# Altium schematic sheet timing.SchDoc
size A4; SheetNumber: 5; SheetTotal: 5
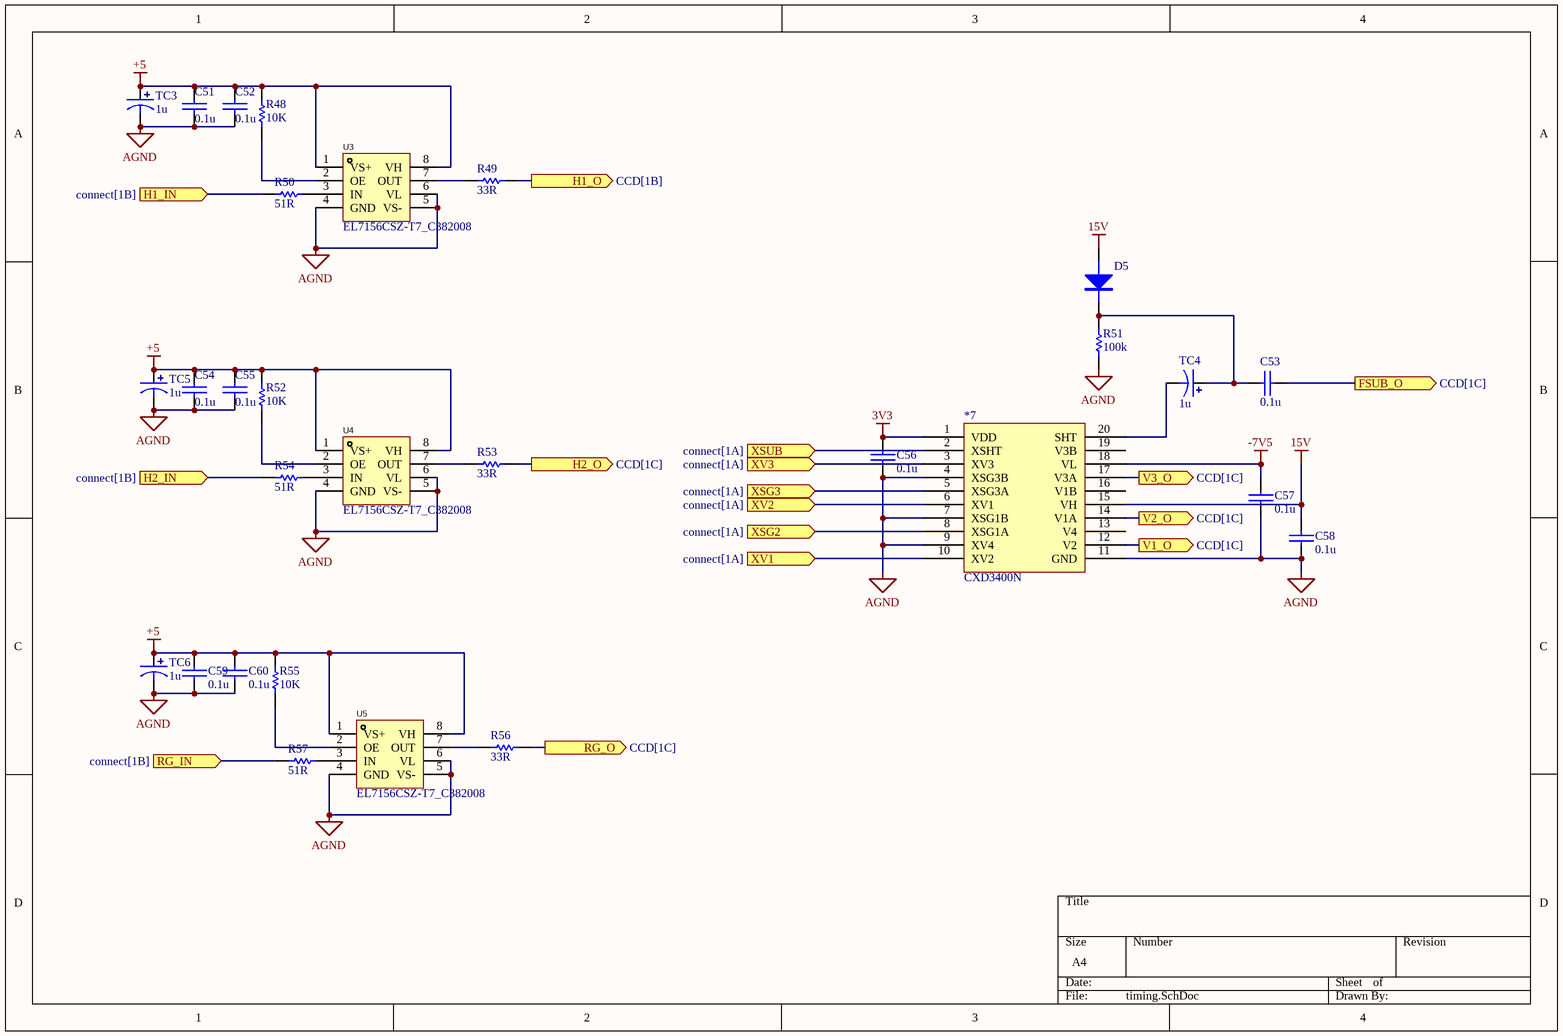
[diagram p0: timing.SchDoc]

## Parts
*7  CXD3400N  [CXD3400N]
C51  0.1u  [0603C]
C52  0.1u  [0603C]
C53  0.1u  [0603C]
C54  0.1u  [0603C]
C55  0.1u  [0603C]
C56  0.1u  [0603C]
C57  0.1u  [0603C]
C58  0.1u  [0603C]
C59  0.1u  [0603C]
C60  0.1u  [0603C]
D5  DIODE  [SMA/DO-214AC]  (value not drawn)
R48  10K  [0603R]
R49  33R  [0603R]
R50  51R  [0603R]
R51  100k  [0603R]
R52  10K  [0603R]
R53  33R  [0603R]
R54  51R  [0603R]
R55  10K  [0603R]
R56  33R  [0603R]
R57  51R  [0603R]
TC3  1u  [TAJ-A/3216]
TC4  1u  [TAJ-A/3216]
TC5  1u  [TAJ-A/3216]
TC6  1u  [TAJ-A/3216]
U3  EL7156CSZ-T7_C382008  [SOIC-8]
U4  EL7156CSZ-T7_C382008  [SOIC-8]
U5  EL7156CSZ-T7_C382008  [SOIC-8]

## Ports
FSUB_O (out, see CCD[1C]), H1_IN (in, see connect[1B]), H1_O (out, see CCD[1B]), H2_IN (in, see connect[1B]), H2_O (out, see CCD[1C]), RG_IN (in, see connect[1B]), RG_O (out, see CCD[1C]), V1_O (out, see CCD[1C]), V2_O (out, see CCD[1C]), V3_O (out, see CCD[1C]), XSG2 (in, see connect[1A]), XSG3 (in, see connect[1A]), XSUB (in, see connect[1A]), XV1 (in, see connect[1A]), XV2 (in, see connect[1A]), XV3 (in, see connect[1A])

## Nets
3V3: *7.1(VDD) C56.2
15V: *7.15(VH) C58.2 D5.A
+5: C51.1 C52.1 C54.1 C55.1 C59.1 C60.1 R48.1 R52.1 R55.1 TC3.1 TC5.1 TC6.1 U3.1(VS+) U3.8(VH) U4.1(VS+) U4.8(VH) U5.1(VS+) U5.8(VH)
-7V5: *7.18(VL) C57.2
AGND: *7.4(XSG3B) *7.7(XSG1B) *7.9(XV4) *7.11(GND) C51.2 C52.2 C54.2 C55.2 C56.1 C57.1 C58.1 C59.2 C60.2 R51.1 TC3.2 TC5.2 TC6.2 U3.4(GND) U3.5(VS-) U3.6(VL) U4.4(GND) U4.5(VS-) U4.6(VL) U5.4(GND) U5.5(VS-) U5.6(VL)
FSUB_O: C53.1 ; port FSUB_O
H1_IN: R50.2 ; port H1_IN
H1_O: R49.1 ; port H1_O
H2_IN: R54.2 ; port H2_IN
H2_O: R53.1 ; port H2_O
RG_IN: R57.2 ; port RG_IN
RG_O: R56.1 ; port RG_O
V1_O: *7.12(V2) ; port V1_O
V2_O: *7.14(V1A) ; port V2_O
V3_O: *7.17(V3A) ; port V3_O
XSG2: *7.8(XSG1A) ; port XSG2
XSG3: *7.5(XSG3A) ; port XSG3
XSUB: *7.2(XSHT) ; port XSUB
XV1: *7.10(XV2) ; port XV1
XV2: *7.6(XV1) ; port XV2
XV3: *7.3(XV3) ; port XV3
Net*7_20: *7.20(SHT) TC4.2
NetC53_2: C53.2 D5.K R51.2 TC4.1
NetR48_2: R48.2 U3.2(OE)
NetR49_2: R49.2 U3.7(OUT)
NetR50_1: R50.1 U3.3(IN)
NetR52_2: R52.2 U4.2(OE)
NetR53_2: R53.2 U4.7(OUT)
NetR54_1: R54.1 U4.3(IN)
NetR55_2: R55.2 U5.2(OE)
NetR56_2: R56.2 U5.7(OUT)
NetR57_1: R57.1 U5.3(IN)

Not connected (* = marked no-connect by the designer): *7 13(V4) 16(V1B) 19(V3B)

## Library data of the parts
*7 = CXD3400N: 6通道垂直时钟驱动器
C51-C60 = CAP: 无极性电容
D5 = DIODE: 普通二极管
R48-R57 = RES: 电阻
TC3-TC6 = TCAP: 钽电容
U3-U5 = EL7156CSZ-T7: 栅极驱动器; Manufacturer: Intersil(英特矽尔); Add into BOM: yes; Name: EL7156CSZ-T7; Symbol: EL7156CSZ-T7; Device: EL7156CSZ-T7_C382008; LCSC Part Name: EL7156CSZ-T7; Supplier Part: C382008; Manufacturer Part: EL7156CSZ-T7; Supplier Footprint: SOIC-8; JLCPCB Part Class: Extended Part; Datasheet: https://atta.szlcsc.com/upload/public/pdf/source/20190409/C382008_2839965C4C72C039364B6D8C7260FFBC.pdf; Supplier: LCSC; Convert to PCB: yes